# Altium schematic sheet Power.SchDoc
size A3; SheetNumber: 2; SheetTotal: 2
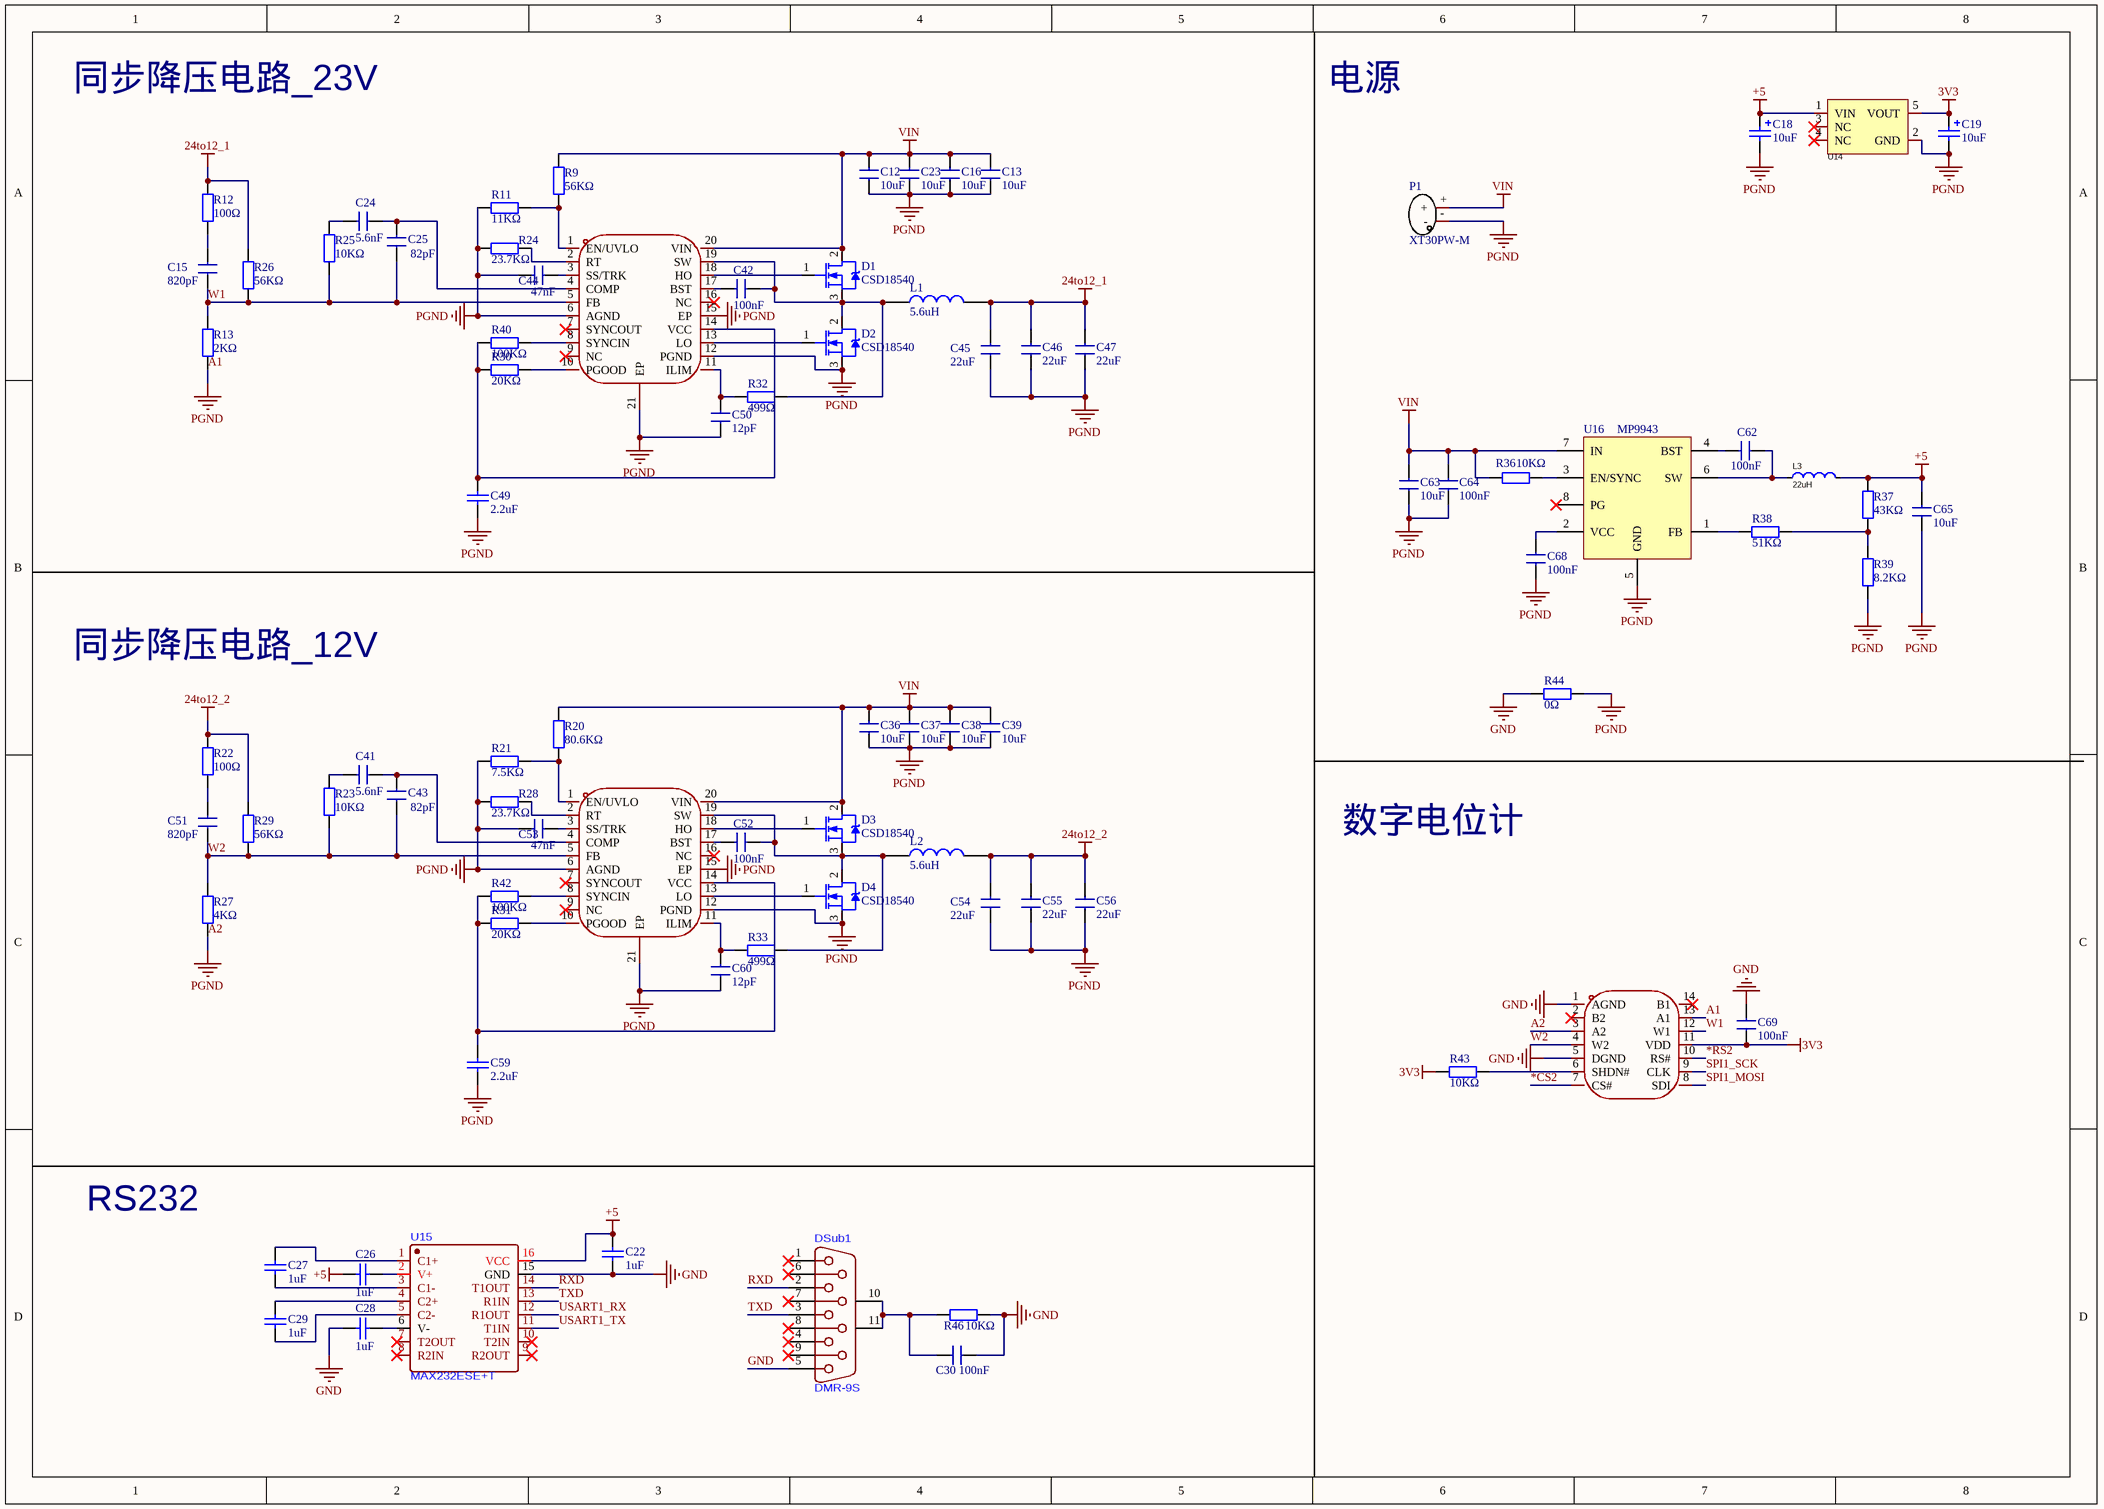
[diagram p0: Power.SchDoc]

## Parts
C12  10uF  [1210]
C13  10uF  [1210]
C15  820pF  [c0402]
C16  10uF  [1210]
C18  10uF  [3216]
C19  10uF  [3216]
C22  1uF  [C 0603_M]
C23  10uF  [1210]
C24  5.6nF  [c0402]
C25  82pF  [c0402]
C26  1uF  [C 0603_M]
C27  1uF  [C 0603_M]
C28  1uF  [C 0603_M]
C29  1uF  [C 0603_M]
C30  100nF  [c0402]
C36  10uF  [1210]
C37  10uF  [1210]
C38  10uF  [1210]
C39  10uF  [1210]
C41  5.6nF  [c0402]
C42  100nF  [C 0603_M]
C43  82pF  [c0402]
C44  47nF  [c0402]
C45  22uF  [1210]
C46  22uF  [1210]
C47  22uF  [1210]
C49  2.2uF  [C 0603_M]
C50  12pF  [c0402]
C51  820pF  [c0402]
C52  100nF  [C 0603_M]
C53  47nF  [c0402]
C54  22uF  [1210]
C55  22uF  [1210]
C56  22uF  [1210]
C59  2.2uF  [C 0603_M]
C60  12pF  [c0402]
C62  100nF  [c0402]
C63  10uF  [1210]
C64  100nF  [c0402]
C65  10uF  [1210]
C68  100nF  [c0402]
C69  100nF  [c0402]
D1  CSD18540  [pg-tdson-8]
D2  CSD18540  [pg-tdson-8]
D3  CSD18540  [pg-tdson-8]
D4  CSD18540  [pg-tdson-8]
DSub1  DMR-9S  [DSUB-TH_DMR-9S]
L1  5.6uH  [L-SMD-0630]
L2  5.6uH  [L-SMD-0630]
L3  22uH  [IND-SMD_L5.4-W5.2]
P1  XT30PW-M  [XT30PW-M]
R9  56KΩ  [R0402]
R11  11KΩ  [R0402]
R12  100Ω  [R0402]
R13  2KΩ  [R0402]
R20  80.6KΩ  [R0402]
R21  7.5KΩ  [R0402]
R22  100Ω  [R0402]
R23  10KΩ  [R0402]
R24  23.7KΩ  [R0402]
R25  10KΩ  [R0402]
R26  56KΩ  [R0402]
R27  4KΩ  [R0402]
R28  23.7KΩ  [R0402]
R29  56KΩ  [R0402]
R30  20KΩ  [R0402]
R31  20KΩ  [R0402]
R32  499Ω  [R0402]
R33  499Ω  [R0402]
R36  10KΩ  [R0402]
R37  43KΩ  [R0402]
R38  51KΩ  [R0402]
R39  8.2KΩ  [R0402]
R40  100KΩ  [R0402]
R42  100KΩ  [R0402]
R43  10KΩ  [R0402]
R44  0Ω  [R0402]
R46  10KΩ  [R0402]
U7  LM25145RGYR  [VQFN-20_L4.5-W3.5-P0.50-BL-EP]  (value not drawn)
U13  LM25145RGYR  [VQFN-20_L4.5-W3.5-P0.50-BL-EP]  (value not drawn)
U14  XC6201P332MR-HXY  [SOT-23-5_L3.0-W1.7-P0.95-LS2.8-BR]  (value not drawn)
U15  MAX232ESE+T  [SOIC-16_L9.9-W3.9-P1.27-LS6.0-BL]
U16  MP9943  [QFN-8 3x3]
U17  AD8402ARZ10-REEL  [SOIC-14_L8.7-W3.9-P1.27-LS6.0-BL]  (value not drawn)

## Nets
3V3: C19.1 C69.2 R43.2 U14.5(VOUT) U17.11(VDD)
24to12_1: C45.2 C46.2 C47.2 L1.2 R12.2 R26.2
24to12_2: C54.2 C55.2 C56.2 L2.2 R22.2 R29.2
+5: C18.1 C22.2 C26.2 C65.2 L3.2 R37.2 U14.1(VIN) U15.16(VCC)
A1: C12.1 C13.1 C16.1 C18.2 C19.2 C23.1 C36.1 C37.1 C38.1 C39.1 C44.2 C45.1 C46.1 C47.1 C49.1 C50.1 C53.2 C54.1 C55.1 C56.1 C59.1 C60.1 C63.1 C64.1 C65.1 C68.1 D2.3(S) D4.3(S) P1.- R11.1 R13.2 R21.1 R24.2 R27.2 R28.2 R39.1 R44.2 U7.6(AGND) U7.12(PGND) U7.15(EP) U7.21(EP) U13.6(AGND) U13.12(PGND) U13.15(EP) U13.21(EP) U14.2(GND) U16.5(GND) U17.3(A2) U17.13(A1)  [also labelled A2, PGND]
GND: C22.1 C28.2 C30.2 C69.1 DSub1.5 R44.1 R46.2 U15.15(GND) U17.1(AGND) U17.5(DGND)
VIN: C12.2 C13.2 C16.2 C23.2 C36.2 C37.2 C38.2 C39.2 C63.2 C64.2 D1.2(D) D3.2(D) P1.+ R9.1 R20.1 R36.1 U7.20(VIN) U13.20(VIN) U16.7(IN)
*CS2: U17.7(CS#)
*RS2: U17.10(RS#)
RXD: DSub1.2 U15.14(T1OUT)
SPI1_MOSI: U17.8(SDI)
SPI1_SCK: U17.9(CLK)
TXD: DSub1.3 U15.13(R1IN)
USART1_RX: U15.12(R1OUT)
USART1_TX: U15.11(T1IN)
W1: C15.2 C25.1 R13.1 R25.1 R26.1 U13.5(FB) U17.12(W1)
W2: C43.1 C51.2 R23.1 R27.1 R29.1 U7.5(FB) U17.4(W2)
NetC15_1: C15.1 R12.1
NetC24_1: C24.1 C25.2 U13.4(COMP)
NetC24_2: C24.2 R25.2
NetC26_1: C26.1 U15.2(V+)
NetC27_1: C27.1 U15.1(C1+)
NetC27_2: C27.2 U15.3(C1-)
NetC28_1: C28.1 U15.6(V-)
NetC29_1: C29.1 U15.4(C2+)
NetC29_2: C29.2 U15.5(C2-)
NetC30_1: C30.1 DSub1.10(MH1) DSub1.11(MH2) R46.1
NetC41_1: C41.1 C43.2 U7.4(COMP)
NetC41_2: C41.2 R23.2
NetC42_1: C42.1 D1.3(S) D2.2(D) L1.1 R32.1 U13.19(SW)
NetC42_2: C42.2 U13.17(BST)
NetC44_1: C44.1 U13.3(SS/TRK)
NetC49_2: C49.2 R30.2 R40.2 U13.14(VCC)
NetC50_2: C50.2 R32.2 U13.11(ILIM)
NetC51_1: C51.1 R22.1
NetC52_1: C52.1 D3.3(S) D4.2(D) L2.1 R33.1 U7.19(SW)
NetC52_2: C52.2 U7.17(BST)
NetC53_1: C53.1 U7.3(SS/TRK)
NetC59_2: C59.2 R31.2 R42.2 U7.14(VCC)
NetC60_2: C60.2 R33.2 U7.11(ILIM)
NetC62_1: C62.1 U16.4(BST)
NetC62_2: C62.2 L3.1 U16.6(SW)
NetC68_2: C68.2 U16.2(VCC)
NetD1_1: D1.1(G) U13.18(HO)
NetD2_1: D2.1(G) U13.13(LO)
NetD3_1: D3.1(G) U7.18(HO)
NetD4_1: D4.1(G) U7.13(LO)
NetR9_2: R9.2 R11.2 U13.1(EN/UVLO)
NetR20_2: R20.2 R21.2 U7.1(EN/UVLO)
NetR24_1: R24.1 U13.2(RT)
NetR28_1: R28.1 U7.2(RT)
NetR30_1: R30.1 U13.10(PGOOD)
NetR31_1: R31.1 U7.10(PGOOD)
NetR36_2: R36.2 U16.3(EN/SYNC)
NetR37_1: R37.1 R38.2 R39.2
NetR38_1: R38.1 U16.1(FB)
NetR40_1: R40.1 U13.8(SYNCIN)
NetR42_1: R42.1 U7.8(SYNCIN)
NetR43_1: R43.1 U17.6(SHDN#)

Not connected (* = marked no-connect by the designer): DSub1 1* 4* 6* 7* 8* 9*; U7 7(SYNCOUT)* 9(NC)* 16(NC)*; U13 7(SYNCOUT)* 9(NC)* 16(NC)*; U14 3(NC)* 4(NC)*; U15 7(T2OUT)* 8(R2IN)* 9(R2OUT)* 10(T2IN)*; U16 8(PG)*; U17 2(B2)* 14(B1)*

## Notes on the sheet
- 同步降压电路_23V
- 电源
- 同步降压电路_12V
- 数字电位计
- RS232

## Library data of the parts
C12 C13 C16 C23 C36-C39 C45-C47 C54-C56 C63 C65 = 1210贴片电容
C15 C24 C25 C30 C41-C44 C50-C53 C60 C62 C64 C68 C69 = 0402贴片电容: 贴片电容0402
C18 C19 = 3216钽电容
C22 C26-C29 C49 C59 = 0603贴片电容
D1-D4 = CSD18540: N沟道MOS管; Note: Pin 2 is electrically connected to pin 4.; Published: 8-Jun-2000; LatestRevisionDate: 17-Jul-2002; LatestRevisionNote: Re-released for DXP Platform.; DatasheetVersion: PD-9.814; PackageVersion: Feb-1997; PackageReference: TO-220AB; Publisher: Altium Limited; PackageDescription: TO, Thru-Hole, Vertical, Heatsink Mounted; 3 In-Line Leads; Pitch 2.54 mm; ComponentLink1Description: Manufacturer Link; ComponentLink1URL: http://www.irf.com/
L1 L2 = 0630功率电感: 一体成型屏蔽电感
L3 = 0530屏蔽电感: 一体成型屏蔽电感，0530封装，额定电流3A; Manufacturer: XR(祥如); Symbol: XR0530-100M; Add into BOM: yes; Value: 10uH; Tolerance: ±20%; Rated Current: 3.2A; Saturation Current (Isat): 3.5A; DC Resistance (DCR): 125mΩ; Type: 一体成型电感; Device: XR0530-100M; LCSC Part Name: 10uH ±20% 3.5A; Supplier Part: C5307602; Manufacturer Part: XR0530-100M; Supplier Footprint: SMD,0530; JLCPCB Part Class: Extended Part; Datasheet: https://atta.szlcsc.com/upload/public/pdf/source/20240328/42FE63A3232C4AF7EB8F1CDEDD5FC69F.pdf; Supplier: LCSC; Convert to PCB: yes
P1 = 卧式XT30母头: LatestRevisionDate: 17-Jul-2002; LatestRevisionNote: Re-released for DXP Platform.; Publisher: Altium Limited
R9 R11-R13 R20-R33 R36-R40 R42-R44 R46 = 0402贴片电阻: W: *
U7 U13 = LM25145RGYR: Manufacturer: TI(德州仪器); Add into BOM: yes; Function: 降压型; Output Type: 可调; Input Voltage: 6V~42V; Output Voltage: 800mV~40V; Output Current: 20A; Switching Frequency: 100kHz~1MHz; Synchronous Rectification: 是; Number of Outputs: 1; Topology: 降压式; Switch tube (built-in/external): 外置; Symbol: LM25145RGYR; Device: LM25145RGYR; LCSC Part Name: LM251456V至42V同步降压直流/直流控制器; Supplier Part: C2876740; Manufacturer Part: LM25145RGYR; Supplier Footprint: VQFN-20-EP(3.5x4.5); JLCPCB Part Class: Extended Part; Datasheet: https://www.ti.com/cn/lit/gpn/lm25145; Supplier: LCSC; Convert to PCB: yes; Operating Temperature: -40℃~+125℃; Quiescent Current (Iq): -
U14 = XC6201P332MR-HXY: 3.3V LDO; Manufacturer: HXY MOSFET(华轩阳电子); Add into BOM: yes; Output Type: 固定; Maximum Input Voltage: 12V; MAX Output Current: 300mA; Output Polarity: 正极; Symbol: XC6201P332MR-HXY; Device: XC6201P332MR-HXY; LCSC Part Name: XC6201P332MR-HXY; Supplier Part: C19626990; Manufacturer Part: XC6201P332MR-HXY; Supplier Footprint: SOT-23-5L; JLCPCB Part Class: Extended Part; Datasheet: https://atta.szlcsc.com/upload/public/pdf/source/20231208/3D7EFECB06481ED5AED4680614D7FFF5.pdf; Supplier: LCSC; Convert to PCB: yes; Output Voltage: 3.3V
U17 = AD8402ARZ10-REEL: Manufacturer: ADI(亚德诺); Add into BOM: yes; Resistance Value (Ohms): 10kΩ; Number of Taps: 256; Number of Channels: 2; Precision: ±20%; Supply Voltage: 2.7V~5.5V; Interface Type: SPI; Temperature Coefficient (Typ): 500ppm/℃; Symbol: AD8402ARZ10-REEL; Device: AD8402ARZ10-REEL; LCSC Part Name: 1-/2-/4-通道数字电位器; Supplier Part: C578716; Manufacturer Part: AD8402ARZ10-REEL; Supplier Footprint: SOIC-14; JLCPCB Part Class: Extended Part; Datasheet: https://atta.szlcsc.com/upload/public/pdf/source/20211026/F04B6EDA79C62679C80111A8307D6AD8.pdf; Supplier: LCSC; Convert to PCB: yes; Operating Temperature: -40℃~+125℃